# EAGLE design mini_pcie_to_uart_usb (EAGLE 9.6.2)

## Sheet 1 of 2
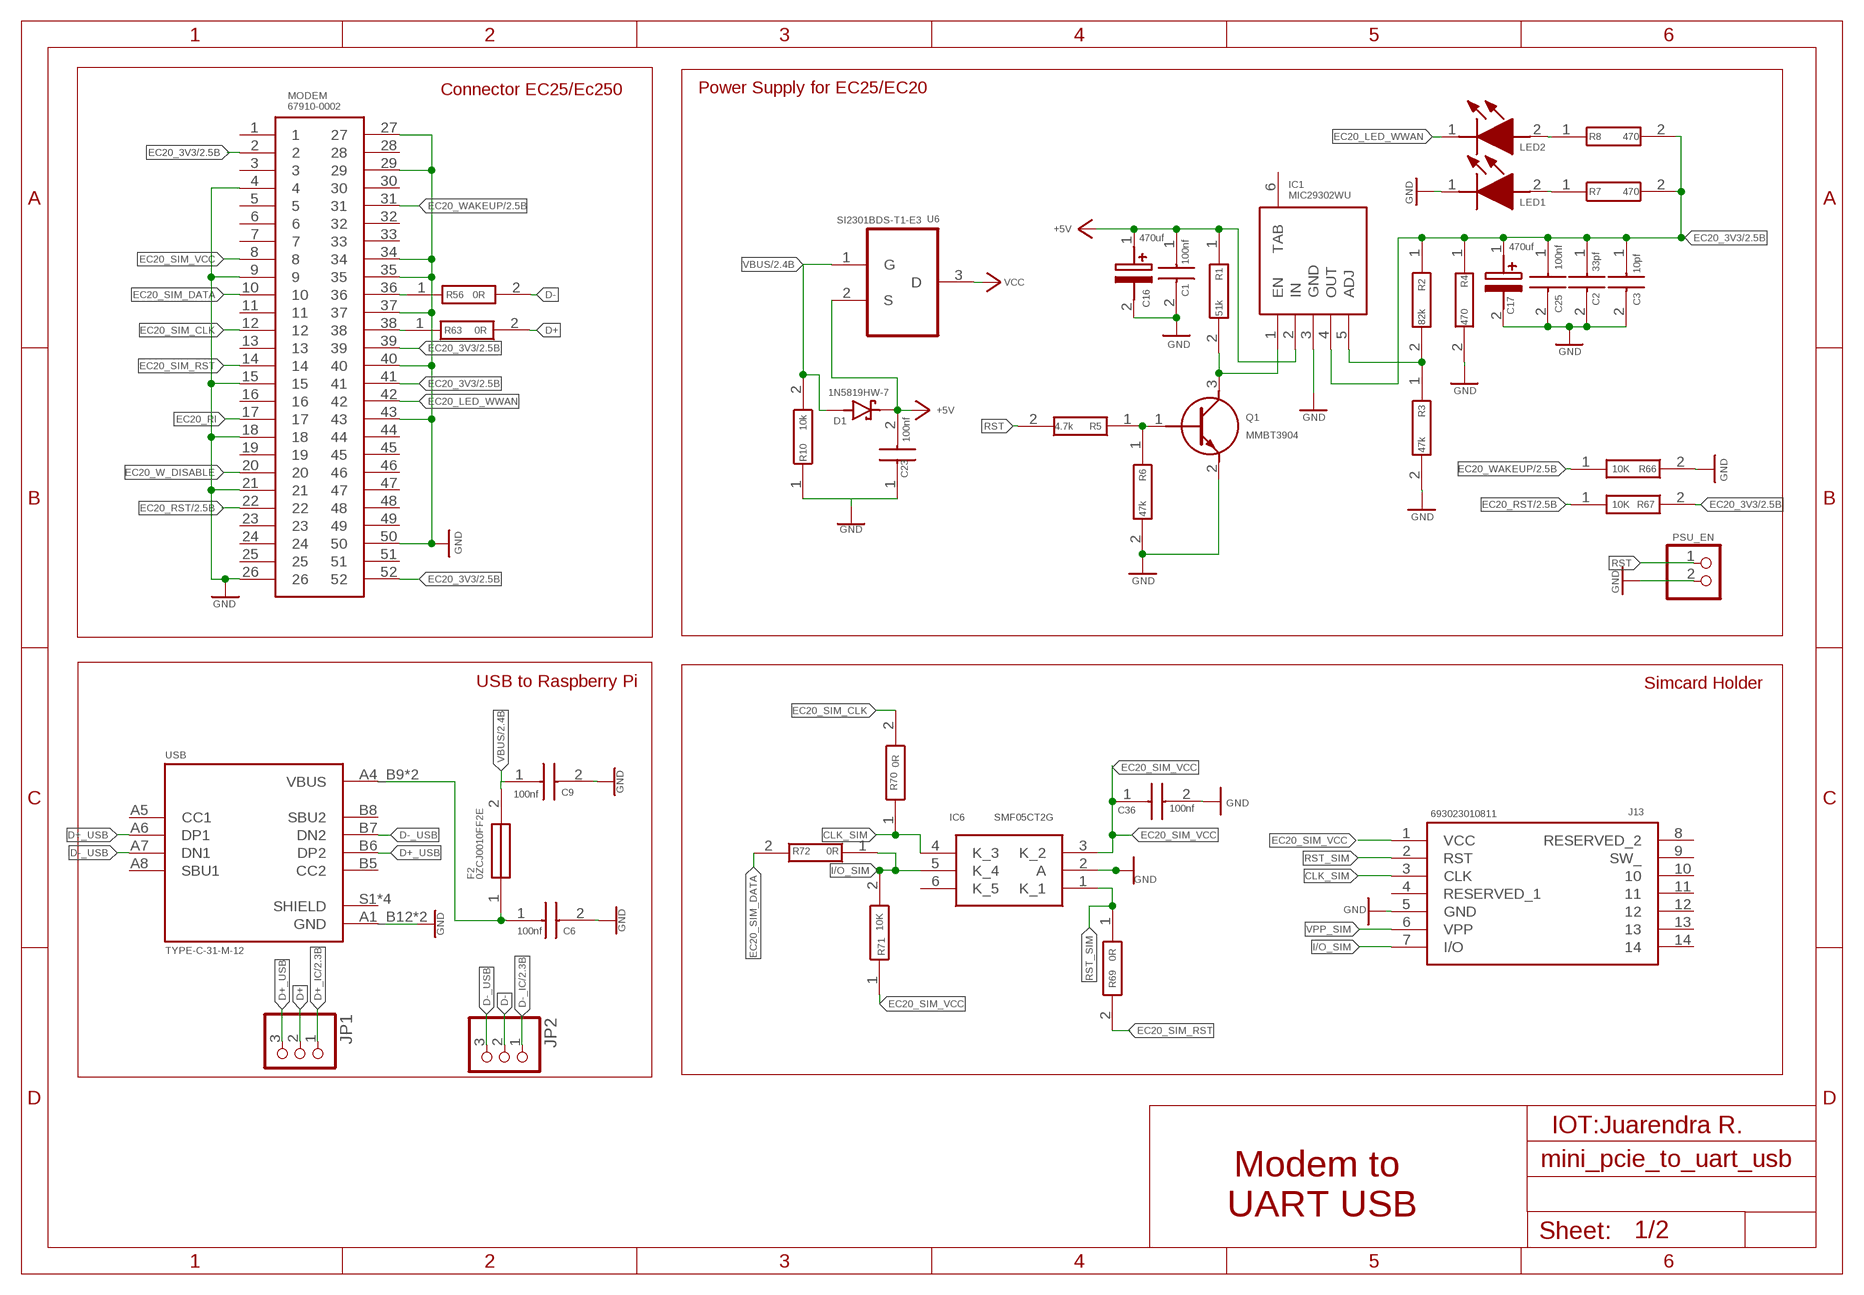
[diagram p0: schematic, sheet 1]

### Parts
C1  100nf  CL10F104ZB8NNNC  [CAPC1608X90N]
C2  33pf  06035A330MAT2A  [CAPC1608X90N]
C3  10pf  06035U100FAT2A  [CAPC1608X90N]
C6  100nf  885012206071  [CAPC1608X87N]
C9  100nf  885012206071  [CAPC1608X87N]
C16  470uf  T55D477M6R3C0030  [CAPPM7343X310N]
C17  470uf  T55D477M6R3C0030  [CAPPM7343X310N]
C23  100nf  885012206071  [CAPC1608X87N]
C25  100nf  CL10F104ZB8NNNC  [CAPC1608X90N]
C36  100nf  CL10F104ZB8NNNC  [CAPC1608X90N]
D1  1N5819HW-7  [SOD3715X145N]
F2  0ZCJ0010FF2E  [FUSC3216X75N]
IC1  MIC29302WU  [MIC29302WU]
IC6  SMF05CT2G  [SOT65P210X110-6N]
J13  693023010811  [693023010811]
JP1  PINHD-1X3  [1X03]
JP2  PINHD-1X3  [1X03]
LED1  HSMR-C170-R0000  [LEDC2012X90N]
LED2  HSMR-C170-R0000  [LEDC2012X90N]
MODEM  67910-0002  [67910-5700]
PSU_EN  PINHD-1X2  [1X02]
Q1  MMBT3904  [SOT95P240X120-3N]
R1  51k  ERJ-PA3F5102V  [ERJP03_PA3_(0603)]
R2  82k  ERJ-P03F8202V  [RESC1609X55N]
R3  47k  ERJ-P03F4702V  [RESC1609X55N]
R4  470  ERJ-P03F4700V  [RESC1609X55N]
R5  4.7k  ERJ-P03F4701V  [RESC1609X55N]
R6  47k  ERJ-P03F4702V  [RESC1609X55N]
R7  470  ERJ-P03F4700V  [RESC1609X55N]
R8  470  ERJ-P03F4700V  [RESC1609X55N]
R10  10k  ESR03EZPJ103  [RESC1608X55N]
R56  0R  CRCW06030000Z0EAC  [RESC1608X55N]
R63  0R  CRCW06030000Z0EAC  [RESC1608X55N]
R66  10K  RT0603DRE0710KL  [RESC1608X55N]
R67  10K  RT0603DRE0710KL  [RESC1608X55N]
R69  0R  CRCW06030000Z0EAC  [RESC1608X55N]
R70  0R  CRCW06030000Z0EAC  [RESC1608X55N]
R71  10K  RT0603DRE0710KL  [RESC1608X55N]
R72  0R  CRCW06030000Z0EAC  [RESC1608X55N]
U6  SI2301BDS-T1-E3  [SOT95P237X112-3N]
USB  TYPE-C-31-M-12  [HRO_TYPE-C-31-M-12]

### Nets
+5V: C1.1 C16.1(+) C23.2 D1.C(K) IC1.2(IN) R1.1 U6.2(S)
CLK_SIM: IC6.4(K_3) J13.3(CLK) R70.1
D+: JP1.2 R63.2
D+_IC: JP1.1 ; also sheet 2
D+_USB: JP1.3 USB.A6(DP1) USB.B6(DP2)
D-: JP2.2 R56.2
D-_IC: JP2.1 ; also sheet 2
D-_USB: JP2.3 USB.A7(DN1) USB.B7(DN2)
EC20_3V3: C2.1 C3.1 C17.1(+) C25.1 IC1.4(OUT) MODEM.2 MODEM.39 MODEM.41 MODEM.52 R2.1 R4.1 R7.2 R8.2 R67.2 ; also sheet 2
EC20_LED_WWAN: LED2.1(K) MODEM.42
EC20_RI: MODEM.17
EC20_RST: MODEM.22 R67.1 ; also sheet 2
EC20_SIM_CLK: MODEM.12 R70.2
EC20_SIM_DATA: MODEM.10 R72.2
EC20_SIM_RST: MODEM.14 R69.2
EC20_SIM_VCC: C36.1 IC6.3(K_2) J13.1(VCC) MODEM.8 R71.1
EC20_W_DISABLE: MODEM.20
EC20_WAKEUP: MODEM.31 R66.1 ; also sheet 2
GND: C1.2 C2.2 C3.2 C6.2 C9.2 C16.2(-) C17.2(-) C23.1 C25.2 C36.2 IC1.3(GND) IC6.2(A) J13.5(GND) LED1.1(K) MODEM.4 MODEM.9 MODEM.15 MODEM.18 MODEM.21 MODEM.26 MODEM.27 MODEM.29 MODEM.34 MODEM.35 MODEM.37 MODEM.40 MODEM.43 MODEM.50 PSU_EN.2 Q1.2(E) R3.2 R4.2 R6.2 R10.1 R66.2 USB.A1_B12(GND) USB.B1_A12(GND) ; also sheet 2
I/O_SIM: IC6.5(K_4) J13.7(I/O) R71.2 R72.1
N$1: IC1.1(EN) Q1.3(C) R1.2
N$2: IC1.5(ADJ) R2.2 R3.1
N$3: Q1.1(B) R5.1 R6.1
N$4: LED1.2(A) R7.1
N$6: C6.1 F2.1 USB.A4_B9(VBUS) USB.B4_A9(VBUS)
N$7: LED2.2(A) R8.1
N$40: MODEM.38 R63.1
N$41: MODEM.36 R56.1
RST: PSU_EN.1 R5.2
RST_SIM: IC6.1(K_1) J13.2(RST) R69.1
VBUS: C9.1 D1.A F2.2 R10.2 U6.1(G) ; also sheet 2
VCC: U6.3(D) ; also sheet 2
VPP_SIM: J13.6(VPP)
Unconnected: IC1.6(TAB) IC6.6(K_5) J13.4(RESERVED_1) J13.8(RESERVED_2) J13.9(SW_) J13.10 J13.11 J13.12 J13.13 J13.14 MODEM.1 MODEM.3 MODEM.5 MODEM.6 MODEM.7 MODEM.11 MODEM.13 MODEM.16 MODEM.19 MODEM.23 MODEM.24 MODEM.25 MODEM.28 MODEM.30 MODEM.32 MODEM.33 MODEM.44 MODEM.45 MODEM.46 MODEM.47 MODEM.48 MODEM.49 MODEM.51 USB.A5(CC1) USB.A8(SBU1) USB.B5(CC2) USB.B8(SBU2) USB.S1(SHIELD) USB.S2(SHIELD) USB.S3(SHIELD) USB.S4(SHIELD)

### Notes on the sheet
- Connector EC25/Ec250 | Power Supply for EC25/EC20
- USB to Raspberry Pi | Simcard Holder
- IOT:Juarendra R.
- Modem to 
  UART USB

## Sheet 2 of 2
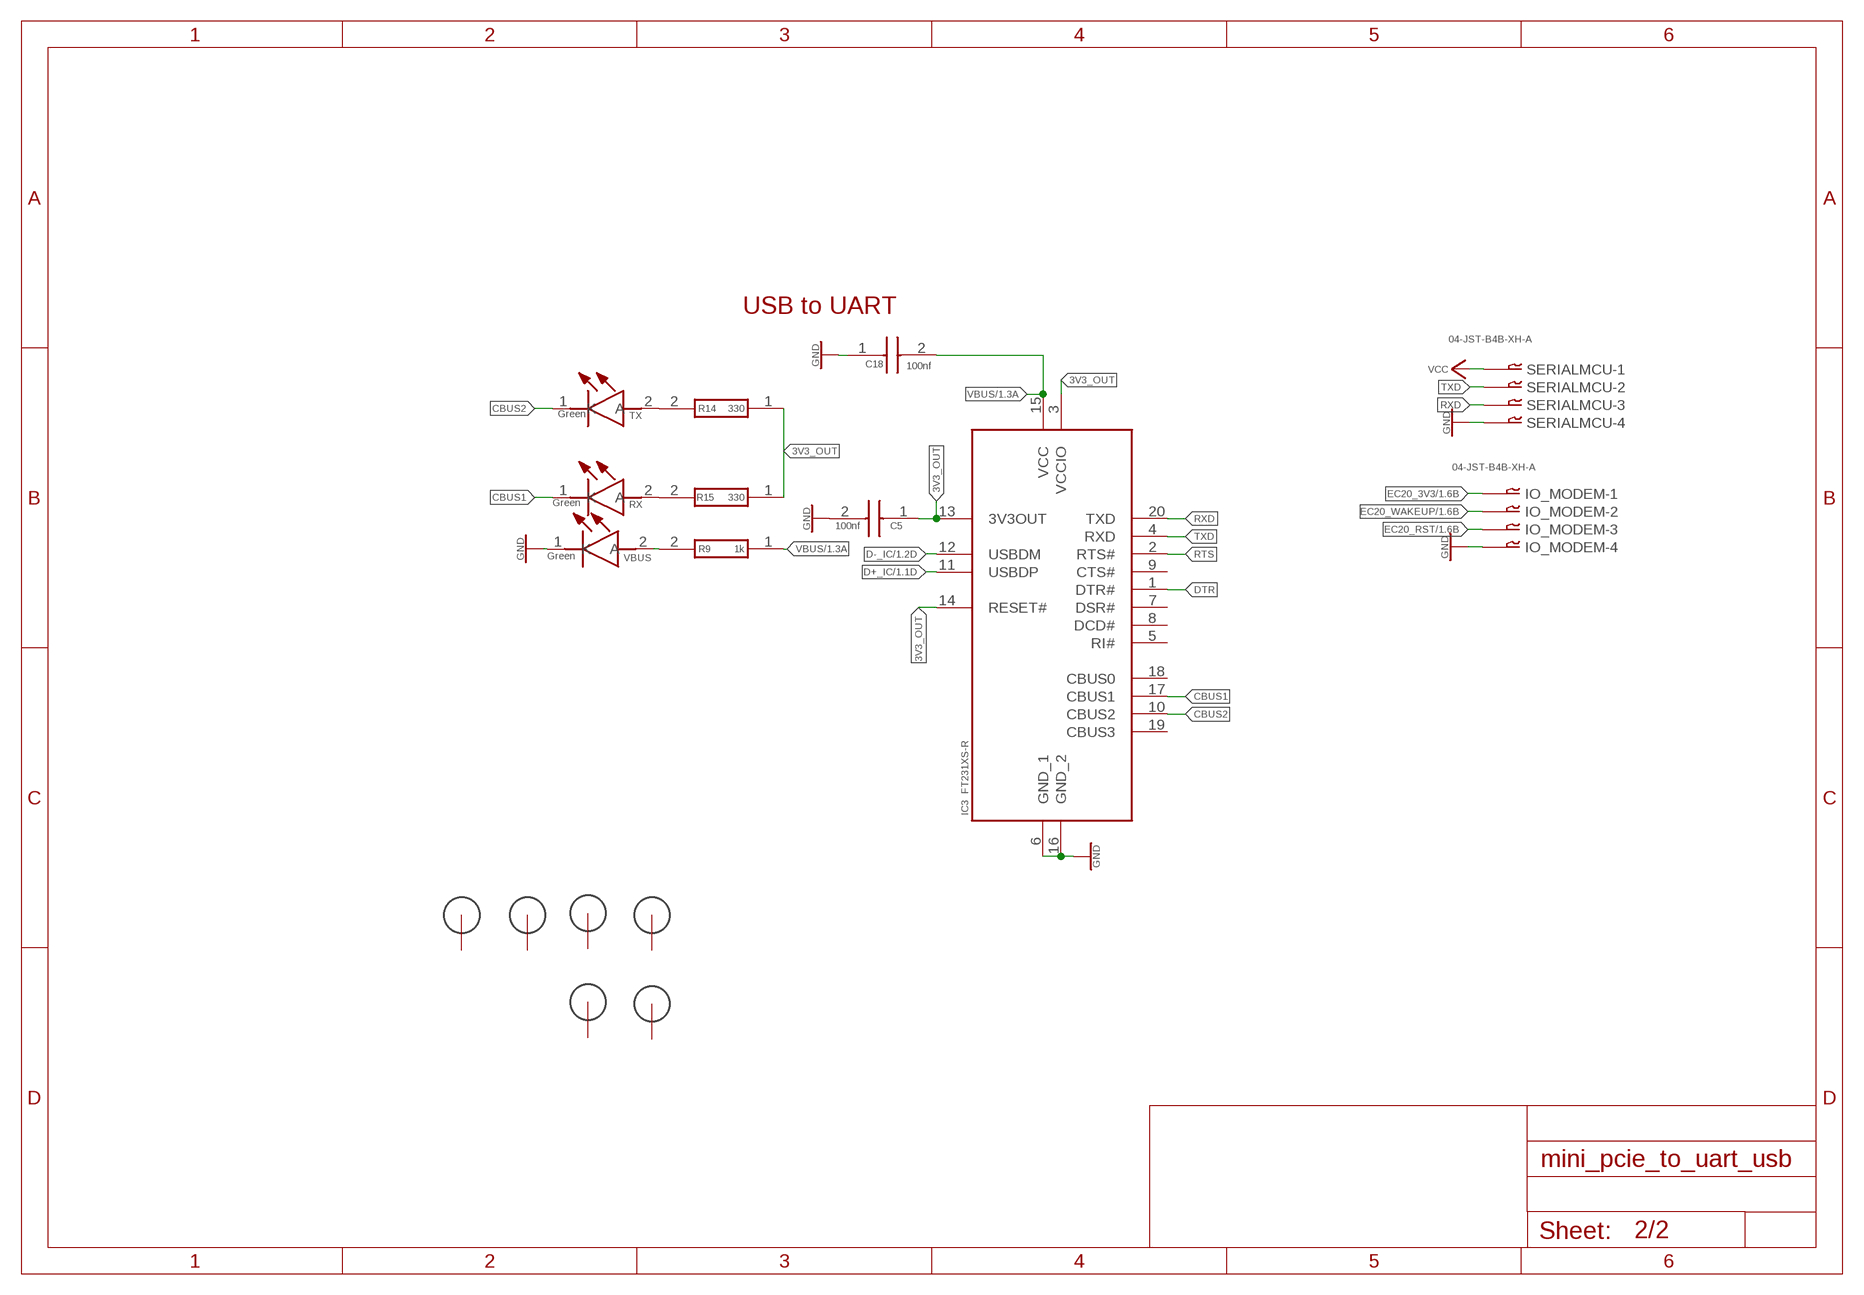
[diagram p1: schematic, sheet 2]

### Parts
C5  100nf  885012206071  [CAPC1608X87N]
C18  100nf  885012206071  [CAPC1608X87N]
H1  3MM_HOLE  [3MM_HOLE]
H2  3MM_HOLE  [3MM_HOLE]
H3  3MM_HOLE  [3MM_HOLE]
H4  3MM_HOLE  [3MM_HOLE]
H5  3MM_HOLE  [3MM_HOLE]
H6  3MM_HOLE  [3MM_HOLE]
IC3  FT231XS-R  [SOP64P599X175-20N]
IO_MODEM  04-JST-B4B-XH-A  [B4B-XH]
R9  1k  ESR03EZPJ102  [RESC1608X55N]
R14  330  ERJ-H3EF3300V  [ERJH3]
R15  330  ERJ-H3EF3300V  [ERJH3]
RX  Green  150080BS75000  [LEDC2012X80N]
SERIALMCU  04-JST-B4B-XH-A  [B4B-XH]
TX  Green  150080BS75000  [LEDC2012X80N]
VBUS  Green  150080BS75000  [LEDC2012X80N]

### Nets
3V3_OUT: C5.1 IC3.3(VCCIO) IC3.13(3V3OUT) IC3.14(RESET#) R14.1 R15.1
CBUS1: IC3.17(CBUS1) RX.1(K)
CBUS2: IC3.10(CBUS2) TX.1(K)
D+_IC: IC3.11(USBDP) ; also sheet 1
D-_IC: IC3.12(USBDM) ; also sheet 1
DTR: IC3.1(DTR#)
EC20_3V3: IO_MODEM.P$1 ; also sheet 1
EC20_RST: IO_MODEM.P$3 ; also sheet 1
EC20_WAKEUP: IO_MODEM.P$2 ; also sheet 1
GND: C5.2 C18.1 IC3.6(GND_1) IC3.16(GND_2) IO_MODEM.P$4 SERIALMCU.P$4 VBUS.1(K) ; also sheet 1
N$5: R15.2 RX.2(A)
N$15: R9.2 VBUS.2(A)
N$20: R14.2 TX.2(A)
RTS: IC3.2(RTS#)
RXD: IC3.20(TXD) SERIALMCU.P$3
TXD: IC3.4(RXD) SERIALMCU.P$2
VBUS: C18.2 IC3.15(VCC) R9.1 ; also sheet 1
VCC: SERIALMCU.P$1 ; also sheet 1
Unconnected: H1.P$1(GND) H1.P$2(GND) H1.P$3(GND) H1.P$4(GND) H1.P$5(GND) H1.P$6(GND) H1.P$7(GND) H1.P$8(GND) H1.P$9(GND) H2.P$1(GND) H2.P$2(GND) H2.P$3(GND) H2.P$4(GND) H2.P$5(GND) H2.P$6(GND) H2.P$7(GND) H2.P$8(GND) H2.P$9(GND) H3.P$1(GND) H3.P$2(GND) H3.P$3(GND) H3.P$4(GND) H3.P$5(GND) H3.P$6(GND) H3.P$7(GND) H3.P$8(GND) H3.P$9(GND) H4.P$1(GND) H4.P$2(GND) H4.P$3(GND) H4.P$4(GND) H4.P$5(GND) H4.P$6(GND) H4.P$7(GND) H4.P$8(GND) H4.P$9(GND) H5.P$1(GND) H5.P$2(GND) H5.P$3(GND) H5.P$4(GND) H5.P$5(GND) H5.P$6(GND) H5.P$7(GND) H5.P$8(GND) H5.P$9(GND) H6.P$1(GND) H6.P$2(GND) H6.P$3(GND) H6.P$4(GND) H6.P$5(GND) H6.P$6(GND) H6.P$7(GND) H6.P$8(GND) H6.P$9(GND) IC3.5(RI#) IC3.7(DSR#) IC3.8(DCD#) IC3.9(CTS#) IC3.18(CBUS0) IC3.19(CBUS3)

### Notes on the sheet
- USB to UART

## Library data of the parts
C1 C25 C36 = Raritan MODEM_GPS:CL10F104ZB8NNNC: Samsung Electro-Mechanics 0603 CL 100nF Ceramic Multilayer Capacitor, 50 V, +85C, Y5V Dielectric, -20 +80% SMD Source: Datasheet; DESCRIPTION: Samsung Electro-Mechanics 0603 CL 100nF Ceramic Multilayer Capacitor, 50 V, +85C, Y5V Dielectric, -20 +80% SMD; HEIGHT: 0.9mm; MANUFACTURER_NAME: Samsung Electro-Mechanics; MANUFACTURER_PART_NUMBER: CL10F104ZB8NNNC; MOUSER_PART_NUMBER: 187-CL10F104ZB8NNNC; MOUSER_PRICE-STOCK: https://www.mouser.co.uk/ProductDetail/Samsung-Electro-Mechanics/CL10F104ZB8NNNC?qs=349EhDEZ59rBbGrsT%2FDZAg%3D%3D
C2 = 06035A330MAT2A:06035A330MAT2A: Multilayer Ceramic Capacitors MLCC - SMD/SMT 50V 33pF C0G 0603 20% Tol Source: Datasheet <https://componentsearchengine.com/Datasheets/1/06035A330MAT2A.pdf>; DESCRIPTION: Multilayer Ceramic Capacitors MLCC - SMD/SMT 50V 33pF C0G 0603 20% Tol; HEIGHT: 0.9mm; MANUFACTURER_NAME: Kyocera AVX; MANUFACTURER_PART_NUMBER: 06035A330MAT2A; MOUSER_PART_NUMBER: 581-06035A330MAT2A; MOUSER_PRICE-STOCK: https://www.mouser.com/Search/Refine.aspx?Keyword=581-06035A330MAT2A
C3 = 06035U100FAT2A:06035U100FAT2A: Multilayer Ceramic Capacitors MLCC - SMD/SMT KGQ15ACG1H100FT NEW GLOBAL PN 50V 10pF C A 581-KGQ15ACG1H100FT Source: Datasheet <https://componentsearchengine.com/Datasheets/1/06031A100FAT2A.pdf>; DESCRIPTION: Multilayer Ceramic Capacitors MLCC - SMD/SMT KGQ15ACG1H100FT NEW GLOBAL PN 50V 10pF C A 581-KGQ15ACG1H100FT; HEIGHT: 0.9mm; MANUFACTURER_NAME: Kyocera AVX; MANUFACTURER_PART_NUMBER: 06035U100FAT2A; MOUSER_PART_NUMBER: 581-06035U100F; MOUSER_PRICE-STOCK: https://www.mouser.co.uk/ProductDetail/KYOCERA-AVX/06035U100FAT2A?qs=TMdO%2Fn%2FCkUL6A7g4po1NrQ%3D%3D
C5 C6 C9 C18 C23 = AccesControlNFC:885012206071: Wurth Elektronik 0603 WCAP-CSGP 100nF Ceramic Multilayer Capacitor, 25 V dc, +125C, X7R Dielectric, +/-10% Source: Datasheet <https://katalog.we-online.com/pbs/datasheet/885012206071.pdf>; DESCRIPTION: Wurth Elektronik 0603 WCAP-CSGP 100nF Ceramic Multilayer Capacitor, 25 V dc, +125C, X7R Dielectric, +/-10%; DIGIKEY_PARTNUMBER: 732-7989-1-ND; DIGIKEY_PRICE-STOCK: https://www.digikey.com/product-detail/en/w%C3%BCrth-elektronik/885012206071/732-7989-1-ND/5454616; HEIGHT: 0.87mm; MANUFACTURER_NAME: Wurth Elektronik; MANUFACTURER_PART_NUMBER: 885012206071; MOUSER_PART_NUMBER: 710-885012206071; MOUSER_PRICE-STOCK: https://www.mouser.co.uk/ProductDetail/Wurth-Elektronik/885012206071?qs=0KOYDY2FL2%2FEBQkuHgvarg%3D%3D
C16 = SamacSys_Parts:T55D477M6R3C0030: Cap Tant Polymer 470uF 6.3VDC D CASE 20% (7.3 X 4.3 X 2.8mm) SMD 7343-30 0.03 Ohm 105C T/R Source: Datasheet <https://www.arrow.com/en/products/t55d477m6r3c0030/vishay>; ARROW_PART_NUMBER: T55D477M6R3C0030; DESCRIPTION: Cap Tant Polymer 470uF 6.3VDC D CASE 20% (7.3 X 4.3 X 2.8mm) SMD 7343-30 0.03 Ohm 105C T/R; HEIGHT: 3.1mm; MANUFACTURER_NAME: Vishay; MANUFACTURER_PART_NUMBER: T55D477M6R3C0030; MOUSER_PART_NUMBER: 74-T55D477M6R3C0030; MOUSER_PRICE-STOCK: https://www.mouser.co.id/ProductDetail/Vishay-Sprague/T55D477M6R3C0030?qs=%2Fha2pyFadui4wZ0nuBUamO9aK%252BYQkDhuleLqs5VgI04AlL4Qf09UDA%3D%3D
C17 = Raritan MODEM_GPS:T55D477M6R3C0030: Cap Tant Polymer 470uF 6.3VDC D CASE 20% (7.3 X 4.3 X 2.8mm) SMD 7343-30 0.03 Ohm 105C T/R Source: Datasheet <https://www.arrow.com/en/products/t55d477m6r3c0030/vishay>; ARROW_PART_NUMBER: T55D477M6R3C0030; DESCRIPTION: Cap Tant Polymer 470uF 6.3VDC D CASE 20% (7.3 X 4.3 X 2.8mm) SMD 7343-30 0.03 Ohm 105C T/R; HEIGHT: 3.1mm; MANUFACTURER_NAME: Vishay; MANUFACTURER_PART_NUMBER: T55D477M6R3C0030; MOUSER_PART_NUMBER: 74-T55D477M6R3C0030; MOUSER_PRICE-STOCK: https://www.mouser.co.id/ProductDetail/Vishay-Sprague/T55D477M6R3C0030?qs=%2Fha2pyFadui4wZ0nuBUamO9aK%252BYQkDhuleLqs5VgI04AlL4Qf09UDA%3D%3D
D1 = 1N5819HW-7:1N5819HW-7: 1N5819HW Series 40 V 1 A Surface Mount Schottky Barrier Rectifier - SOD-123 Check availability <https://pricing.snapeda.com/parts/1N5819HW-7/Diodes%20Inc./view-part?ref=eda>; AVAILABILITY: In Stock; CHECK_PRICES: https://www.snapeda.com/parts/1N5819HW-7/Diodes+Inc./view-part/?ref=eda; DESCRIPTION: Diode Schottky 40 V 1A Surface Mount SOD-123; MF: Diodes Inc.; MP: 1N5819HW-7; PACKAGE: SOD-123 Fairchild Semiconductor; PRICE: None; PURCHASE-URL: https://www.snapeda.com/api/url_track_click_mouser/?unipart_id=51510&manufacturer=Diodes Inc.&part_name=1N5819HW-7&search_term=1n5819; SNAPEDA_LINK: https://www.snapeda.com/parts/1N5819HW-7/Diodes+Inc./view-part/?ref=snap
F2 = 0ZCJ0010FF2E:0ZCJ0010FF2E: Resettable Fuses - PPTC Fuse Source: Datasheet <https://componentsearchengine.com/Datasheets/1/0ZCJ0010FF2E.pdf>; DESCRIPTION: Resettable Fuses - PPTC Fuse; HEIGHT: 0.75mm; MANUFACTURER_NAME: BelFuse; MANUFACTURER_PART_NUMBER: 0ZCJ0010FF2E; MOUSER_PART_NUMBER: 530-0ZCJ0010FF2E; MOUSER_PRICE-STOCK: https://www.mouser.co.uk/ProductDetail/Bel-Fuse/0ZCJ0010FF2E?qs=SRYZG9HaIQ2ZPdy0ahZ08g%3D%3D
H1-H6 = 3mm_special_hole:3MM_HOLE: Cool looking 3mm hole with ground connection
IC1 = MIC29302WU:MIC29302WU: LDO Voltage Regulators 3.0A LDO Adj. + Shutdown Source: Datasheet <https://www.mouser.in/datasheet/2/268/MIC2915x_30x_50x_75x_High_Current_Low_Dropout_Regu-1889172.pdf>; DESCRIPTION: LDO Voltage Regulators 3.0A LDO Adj. + Shutdown; HEIGHT: 5.08mm; MANUFACTURER_NAME: Microchip; MANUFACTURER_PART_NUMBER: MIC29302WU; MOUSER_PART_NUMBER: 998-MIC29302WU; MOUSER_PRICE-STOCK: https://www.mouser.co.uk/ProductDetail/Microchip-Technology/MIC29302WU?qs=kh6iOki%2FeLGH5fS1ZBQ3pA%3D%3D
IC3 = AccesControlNFC:FT231XS-R: FTDI Chip FT231XS-R, Interface RS232, RS422, RS485, SIE, UART 3MBd, 5 V, 20-pin, SSOP Source: Datasheet; DESCRIPTION: FTDI Chip FT231XS-R, Interface RS232, RS422, RS485, SIE, UART 3MBd, 5 V, 20-pin, SSOP; HEIGHT: 1.753mm; MANUFACTURER_NAME: FTDI Chip; MANUFACTURER_PART_NUMBER: FT231XS-R; MOUSER_PART_NUMBER: 895-FT231XS-R; MOUSER_PRICE-STOCK: https://www.mouser.co.uk/ProductDetail/FTDI/FT231XS-R?qs=Gp1Yz1mis3WduRPsgrTbtg%3D%3D
IC6 = SMF05CT2G:SMF05CT2G: 5-Line Transient Voltage Suppressor Array Source: Datasheet <http://www.onsemi.com/pub/Collateral/SMF05C-D.PDF>; DESCRIPTION: 5-Line Transient Voltage Suppressor Array; HEIGHT: 1.1mm; MANUFACTURER_NAME: onsemi; MANUFACTURER_PART_NUMBER: SMF05CT2G; MOUSER_PART_NUMBER: 863-SMF05CT2G; MOUSER_PRICE-STOCK: https://www.mouser.co.uk/ProductDetail/onsemi/SMF05CT2G?qs=xZq1yRCsb1fkTB9yOMghAg%3D%3D
IO_MODEM SERIALMCU = AccesControlNFC:04-JST: JST CONNECTOR
J13 = Raritan MODEM_GPS:693023010811: Micro SIMPushPull-Card Detection Source: Datasheet <https://katalog.we-online.com/em/datasheet/693023010811.pdf>; DESCRIPTION: Micro SIMPushPull-Card Detection; HEIGHT: 4mm; MANUFACTURER_NAME: Wurth Elektronik; MANUFACTURER_PART_NUMBER: 693023010811; MOUSER_PART_NUMBER: 710-693023010811; MOUSER_PRICE-STOCK: https://www.mouser.co.uk/ProductDetail/Wurth-Elektronik/693023010811?qs=a9WhcLg8qCwvzFrXNR2ZFw%3D%3D
JP1 JP2 = pinhead:PINHD-1X3: PIN HEADER
LED1 LED2 = HSMR-C170-R0000:HSMR-C170-R0000: CHIP,TOP MT,INGAN,BLUE - Bulk Source: Datasheet <https://docs.broadcom.com/docs/HSMR-C170-R0000-DS100>; DESCRIPTION: CHIP,TOP MT,INGAN,BLUE - Bulk; HEIGHT: 0.9mm; MANUFACTURER_NAME: Avago Technologies; MANUFACTURER_PART_NUMBER: HSMR-C170-R0000; MOUSER_PART_NUMBER: 630-HSMR-C170-R0000; MOUSER_PRICE-STOCK: https://www.mouser.co.uk/ProductDetail/Broadcom-Avago/HSMR-C170-R0000?qs=tMOYG%252Bw4%252BLw%2FIfre%252BXKNxw%3D%3D
MODEM = Raritan MODEM_GPS:67910-0002: Molex 67910 Series, Right Angle PCB Edge Connector SMT, 52 Way, 0.8mm Pitch, 1.1A Source: Datasheet; DESCRIPTION: Molex 67910 Series, Right Angle PCB Edge Connector SMT, 52 Way, 0.8mm Pitch, 1.1A; DIGIKEY_PARTNUMBER: WM3470CT-ND; DIGIKEY_PRICE-STOCK: https://www.digikey.com/product-detail/en/molex/0679100002/WM3470CT-ND/2405686; HEIGHT: mm; MANUFACTURER_NAME: Molex; MANUFACTURER_PART_NUMBER: 67910-0002; MOUSER_PART_NUMBER: 538-67910-0002; MOUSER_PRICE-STOCK: https://www.mouser.co.uk/ProductDetail/Molex/67910-0002?qs=Nl1avnnkqqxGh9Vp1ExzfQ%3D%3D
PSU_EN = pinhead:PINHD-1X2: PIN HEADER
Q1 = MMBT3904:MMBT3904: SOT-23-3 Source: Datasheet <https://www.onsemi.com/download/data-sheet/pdf/PZT3904-D.pdf>; DESCRIPTION: SOT-23-3; HEIGHT: 1.2mm; MANUFACTURER_NAME: onsemi; MANUFACTURER_PART_NUMBER: MMBT3904; MOUSER_PART_NUMBER: 512-MMBT3904; MOUSER_PRICE-STOCK: https://www.mouser.co.uk/ProductDetail/onsemi-Fairchild/MMBT3904?qs=UMEuL5FsraCg3xKjS4uBJQ%3D%3D
R1 = ERJ-PA3F5102V:ERJ-PA3F5102V: Panasonic ERJPA3 Series Thick Film Surface Mount Resistor 0603 Case 51k +/-1% 0.25W +/-100ppm/C Source: Datasheet <https://componentsearchengine.com/Datasheets/1/ERJ-PA3F5102V.pdf>; DESCRIPTION: Panasonic ERJPA3 Series Thick Film Surface Mount Resistor 0603 Case 51k +/-1% 0.25W +/-100ppm/C; HEIGHT: 0.55mm; MANUFACTURER_NAME: Panasonic; MANUFACTURER_PART_NUMBER: ERJ-PA3F5102V; MOUSER_PART_NUMBER: 667-ERJ-PA3F5102V; MOUSER_PRICE-STOCK: https://www.mouser.com/Search/Refine.aspx?Keyword=667-ERJ-PA3F5102V
R2 = ERJ-P03F8202V:ERJ-P03F8202V: Anti-Surge Thick Film Chip Resistor, 0603 Source: Datasheet <http://industrial.panasonic.com/cdbs/www-data/pdf/RDA0000/AOA0000C102.pdf>; DESCRIPTION: Anti-Surge Thick Film Chip Resistor, 0603; HEIGHT: 0.55mm; MANUFACTURER_NAME: Panasonic; MANUFACTURER_PART_NUMBER: ERJ-P03F8202V
R3 R6 = ERJ-P03F4702V:ERJ-P03F4702V: Thick Film Resistors - SMD 0603 47Kohms 0.2W 1% AEC-Q200 Source: Datasheet <https://componentsearchengine.com/Datasheets/1/ERJ-P03F4702V.pdf>; DESCRIPTION: Thick Film Resistors - SMD 0603 47Kohms 0.2W 1% AEC-Q200; HEIGHT: 0.55mm; MANUFACTURER_NAME: Panasonic; MANUFACTURER_PART_NUMBER: ERJ-P03F4702V; MOUSER_PART_NUMBER: 667-ERJ-P03F4702V; MOUSER_PRICE-STOCK: http://www.mouser.com/Search/ProductDetail.aspx?qs=18kBAoNi3c80quo7IiLR5w%3d%3d
R4 R7 R8 = ERJ-P03F4700V:ERJ-P03F4700V: Thick Film Resistors - SMD 0603 470ohms 0.2W 1% AEC-Q200 Source: Datasheet <http://industrial.panasonic.com/cdbs/www-data/pdf/RDA0000/AOA0000C102.pdf>; DESCRIPTION: Thick Film Resistors - SMD 0603 470ohms 0.2W 1% AEC-Q200; HEIGHT: 0.55mm; MANUFACTURER_NAME: Panasonic; MANUFACTURER_PART_NUMBER: ERJ-P03F4700V; MOUSER_PART_NUMBER: 667-ERJ-P03F4700V; MOUSER_PRICE-STOCK: https://www.mouser.co.uk/ProductDetail/Panasonic/ERJ-P03F4700V?qs=18kBAoNi3c9N6jeKRfIb9g%3D%3D
R5 = ERJ-P03F4701V:ERJ-P03F4701V: Thick Film Resistors - SMD 0603 4.7Kohms 0.2W 1% AEC-Q200 Source: Datasheet <http://industrial.panasonic.com/cdbs/www-data/pdf/RDA0000/AOA0000C102.pdf>; DESCRIPTION: Thick Film Resistors - SMD 0603 4.7Kohms 0.2W 1% AEC-Q200; HEIGHT: 0.55mm; MANUFACTURER_NAME: Panasonic; MANUFACTURER_PART_NUMBER: ERJ-P03F4701V; MOUSER_PART_NUMBER: 667-ERJ-P03F4701V; MOUSER_PRICE-STOCK: https://www.mouser.co.uk/ProductDetail/Panasonic/ERJ-P03F4701V?qs=18kBAoNi3c9lrldXCbY57g%3D%3D
R9 = AccesControlNFC:ESR03EZPJ102: Thick Film Resistors - SMD 0603 1Kohm 5% Anti Surge AEC-Q200 Source: Datasheet <http://www.rohm.com/web/global/datasheet/ESR01MZPF/esr-e>; DESCRIPTION: Thick Film Resistors - SMD 0603 1Kohm 5% Anti Surge AEC-Q200; DIGIKEY_PARTNUMBER: RHM1.0KDCT-ND; DIGIKEY_PRICE-STOCK: https://www.digikey.com/product-detail/en/rohm-semiconductor/ESR03EZPJ102/RHM1-0KDCT-ND/1762924; HEIGHT: 0.55mm; MANUFACTURER_NAME: ROHM Semiconductor; MANUFACTURER_PART_NUMBER: ESR03EZPJ102; MOUSER_PART_NUMBER: 755-ESR03EZPJ102; MOUSER_PRICE-STOCK: https://www.mouser.co.uk/ProductDetail/ROHM-Semiconductor/ESR03EZPJ102?qs=DyUWGjl%252BcVvjMuV%252BzioV7Q%3D%3D
R10 = AccesControlNFC:ESR03EZPJ103: Thick Film Resistors - SMD 0603 10Kohm 5% Anti Surge AEC-Q200 Source: Datasheet <https://componentsearchengine.com/Datasheets/1/ESR03EZPJ103.pdf>; DESCRIPTION: Thick Film Resistors - SMD 0603 10Kohm 5% Anti Surge AEC-Q200; DIGIKEY_PARTNUMBER: RHM10KDCT-ND; DIGIKEY_PRICE-STOCK: https://www.digikey.com/product-detail/en/rohm-semiconductor/ESR03EZPJ103/RHM10KDCT-ND/1762925; HEIGHT: 0.55mm; MANUFACTURER_NAME: ROHM Semiconductor; MANUFACTURER_PART_NUMBER: ESR03EZPJ103; MOUSER_PART_NUMBER: 755-ESR03EZPJ103; MOUSER_PRICE-STOCK: https://www.mouser.com/Search/Refine.aspx?Keyword=755-ESR03EZPJ103
R14 R15 = AccesControlNFC:ERJ-H3EF3300V: Power Rating 0.125W,Resistance 330 Ohm,LxW(EIA) 1.6 x 0.8 (EIA:0603) mm Source: Datasheet <http://industrial.panasonic.com/cdbs/www-data/pdf/RDQ0000/ast-ind-151033.pdf>; DESCRIPTION: Power Rating 0.125W,Resistance 330 Ohm,LxW(EIA) 1.6 x 0.8 (EIA:0603) mm; HEIGHT: mm; MANUFACTURER_NAME: Panasonic; MANUFACTURER_PART_NUMBER: ERJ-H3EF3300V; MOUSER_PART_NUMBER: 667-ERJ-H3EF3300V; MOUSER_PRICE-STOCK: https://www.mouser.co.uk/ProductDetail/Panasonic/ERJ-H3EF3300V?qs=eP2BKZSCXI61roRLPi8W7w%3D%3D
R56 R63 R69 R70 R72 = Raritan MODEM_GPS:CRCW06030000Z0EAC: Thick Film Resistors - SMD Source: Datasheet <https://www.vishay.com/docs/28773/crcwce3.pdf>; DESCRIPTION: Thick Film Resistors - SMD; DIGIKEY_PARTNUMBER: 541-4012-1-ND; DIGIKEY_PRICE-STOCK: https://www.digikey.com/product-detail/en/vishay-dale/CRCW06030000Z0EAC/541-4012-1-ND/7928695; HEIGHT: 0.55mm; MANUFACTURER_NAME: Vishay; MANUFACTURER_PART_NUMBER: CRCW06030000Z0EAC; MOUSER_PART_NUMBER: 71-CRCW06030000Z0EAC; MOUSER_PRICE-STOCK: https://www.mouser.co.uk/ProductDetail/Vishay-Dale/CRCW06030000Z0EAC?qs=E3Y5ESvWgWPIXY%2FelhkL3A%3D%3D
R66 R67 R71 = Raritan MODEM_GPS:RT0603DRE0710KL: Thin Film Resistors - SMD 10K ohm 0.5% 1/10W Source: Datasheet <https://datasheet.datasheetarchive.com/originals/distributors/Datasheets_SAMA/a1f8f48f216d234b3e6a96d43a77a0c1.pdf>; DESCRIPTION: Thin Film Resistors - SMD 10K ohm 0.5% 1/10W; HEIGHT: 0.55mm; MANUFACTURER_NAME: YAGEO (PHYCOMP); MANUFACTURER_PART_NUMBER: RT0603DRE0710KL
RX TX VBUS = AccesControlNFC:150080BS75000: LED,Wurth Elektronik,150080BS75000 Wurth Elektronik 150080BS75000, WL-SMCW Series Blue LED, 470 nm 2012 (0805) Clear, Rectangle Lens SMD package Source: Datasheet <https://katalog.we-online.com/led/datasheet/150080BS75000.pdf>; DESCRIPTION: LED,Wurth Elektronik,150080BS75000 Wurth Elektronik 150080BS75000, WL-SMCW Series Blue LED, 470 nm 2012 (0805) Clear, Rectangle Lens SMD package; HEIGHT: 0.8mm; MANUFACTURER_NAME: Wurth Elektronik; MANUFACTURER_PART_NUMBER: 150080BS75000; MOUSER_PART_NUMBER: 710-150080BS75000; MOUSER_PRICE-STOCK: https://www.mouser.co.uk/ProductDetail/Wurth-Elektronik/150080BS75000?qs=2kOmHSv6VfT2tBo3UPVqAQ%3D%3D
U6 = SI2301BDS-T1-E3:SI2301BDS-T1-E3: MOSFET Check availability <https://pricing.snapeda.com/parts/SI2301BDS-T1-E3/Vishay/view-part?ref=eda>; AVAILABILITY: In Stock; CHECK_PRICES: https://www.snapeda.com/parts/SI2301BDS-T1-E3/Vishay+Siliconix/view-part/?ref=eda; DESCRIPTION: MOSFET,P-Ch,VDSS -20V,RDS(ON) 0.08Ohm,ID -2.2A,TO-236 (SOT-23),PD 0.7W,VGS +/-8V | Siliconix / Vishay SI2301BDS-T1-E3; MF: Vishay; MP: SI2301BDS-T1-E3; PACKAGE: SOT-23-3 Vishay Siliconix; PRICE: None; PURCHASE-URL: https://www.snapeda.com/api/url_track_click_mouser/?unipart_id=277675&manufacturer=Vishay&part_name=SI2301BDS-T1-E3&search_term=si2301; SNAPEDA_LINK: https://www.snapeda.com/parts/SI2301BDS-T1-E3/Vishay+Siliconix/view-part/?ref=snap
USB = TYPE-C-31-M-12:TYPE-C-31-M-12: Check availability <https://pricing.snapeda.com/parts/TYPE-C-31-M-12/HRO%20Electronics%20Co.%2C%20Ltd./view-part?ref=eda>; AVAILABILITY: Not in stock; CHECK_PRICES: https://www.snapeda.com/parts/TYPE-C-31-M-12/HRO+Electronics+Co.%252C+Ltd./view-part/?ref=eda; DESCRIPTION: USB Connectors 24 Receptacle 1 8.94*7.3mm RoHS; MF: HRO Electronics Co., Ltd.; MP: TYPE-C-31-M-12; PACKAGE: Package; PRICE: None; SNAPEDA_LINK: https://www.snapeda.com/parts/TYPE-C-31-M-12/HRO+Electronics+Co.%252C+Ltd./view-part/?ref=snap

## Board
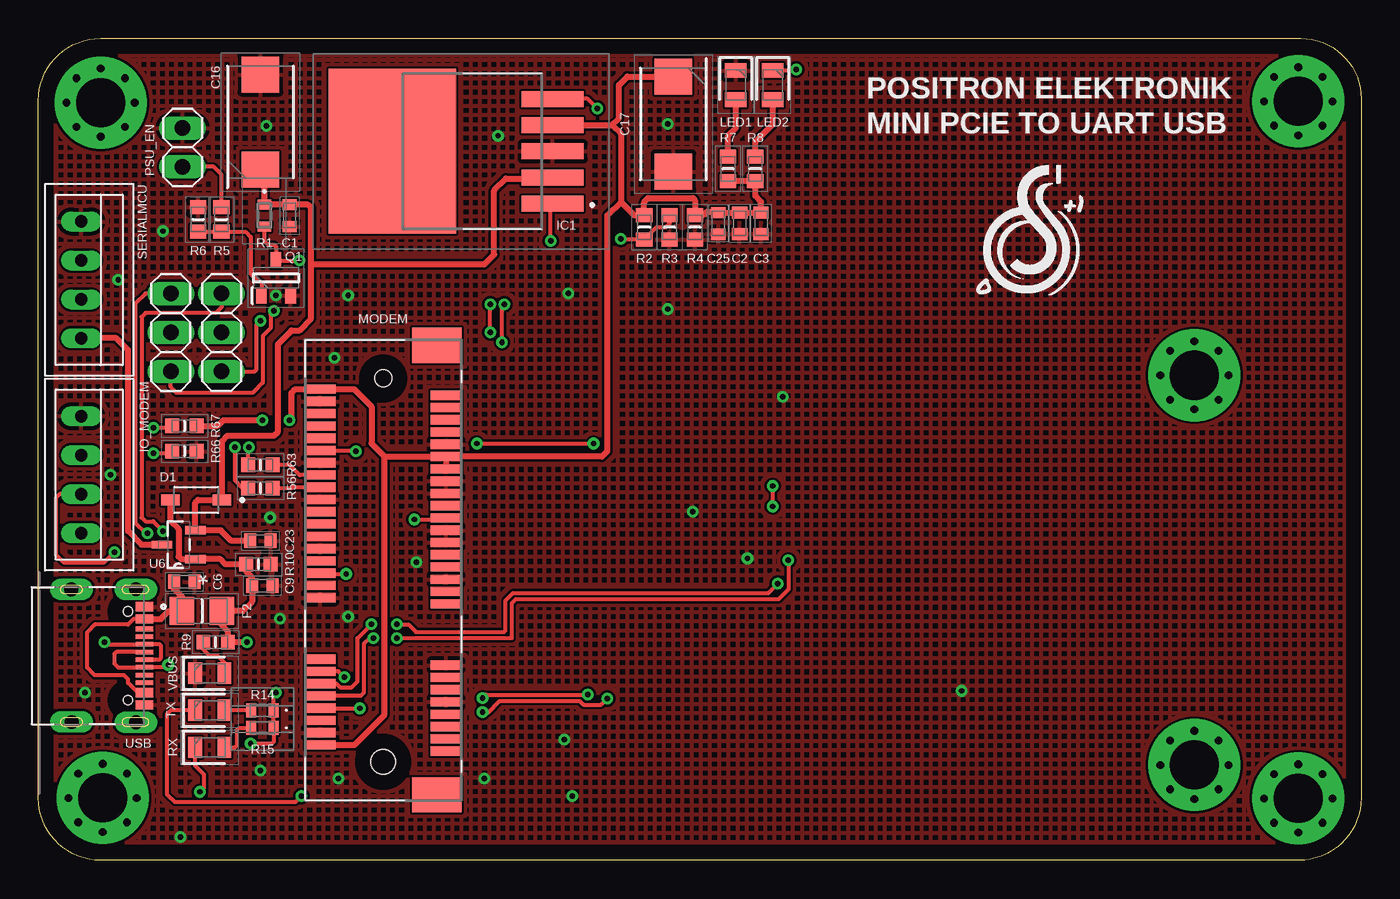
[diagram p2: board, top side]
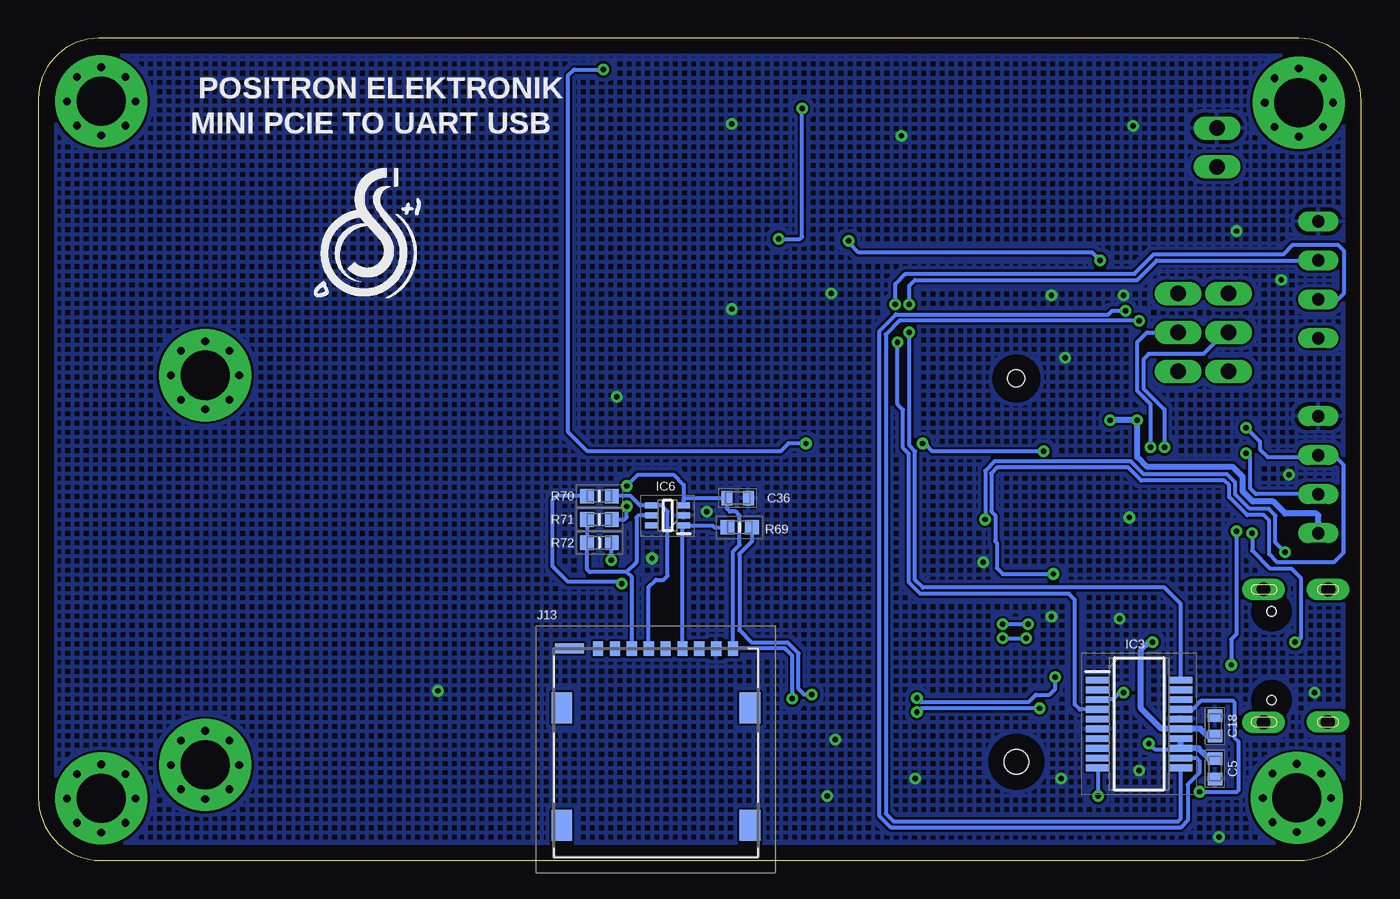
[diagram p3: board, bottom side, seen from below]

Size 86.23 x 53.59 mm. Coordinates in mm from the lower left corner, seen from the top.
Outline: 82.3,53.59 arc-90 86.23,49.66 86.23,4.06 arc-90 82.17,0 4.06,0 arc-90 0,4.06 0,49.53 arc-90 4.06,53.59 82.3,53.59
Copper layers (1*16): Top 0.035mm / dielectric 1.5mm / Bottom 0.035mm
Design rules "default *": minimum track width 6mil, minimum drill 0.35mm, track to track 6mil, track to pad 6mil, pad to pad 6mil, via to via 6mil, smd to smd 6mil, copper to edge 40mil, drill to drill 6mil, minimum pad ring 10mil, minimum via ring 8mil, stop-mask expansion 4mil, vias tented up to drill 0.35mm, thermal gap 10mil

### Footprints (pad centres in the part's own frame; a part is rotated, then mirrored left to right if it is on the bottom)
CAPC1608X90N = smd 0.73 x 0.94: 1 -0.71,0; 2 0.71,0
CAPC1608X90N' = smd 0.78 x 0.99: 1 -0.7,0; 2 0.7,0
CAPC1608X87N = smd 0.8 x 0.94: 1 -0.67,0; 2 0.67,0
CAPPM7343X310N = smd 2.35 x 2.45: 1 -3.1,0; 2 3.1,0
SOD3715X145N = smd 1.21 x 0.73: A 1.68,0; C -1.68,0
FUSC3216X75N = smd 1.61 x 1.82: 1 -1.3,0; 2 1.3,0
3MM_HOLE = drill 3.2 pad 6: P$1 0,0 | drill 0.5 pad 0.61: P$2 0,2.223; P$3 0,-2.223; P$4 2.223,0; P$5 -2.223,0; P$6 -1.587,1.587; P$7 1.587,1.587; P$8 1.587,-1.587; P$9 -1.587,-1.587
MIC29302WU = smd 1.041 x 4.039: 1 -3.404,0; 2 -1.702,0; 3 0,0; 4 1.702,0; 5 3.404,0 | smd 10.744 x 8.306: 6 0,10.452
SOP64P599X175-20N = smd 1.526 x 0.435: 1 -2.712,2.858; 2 -2.712,2.222; 3 -2.712,1.588; 4 -2.712,0.952; 5 -2.712,0.318; 6 -2.712,-0.318; 7 -2.712,-0.952; 8 -2.712,-1.588; 9 -2.712,-2.222; 10 -2.712,-2.858; 11 2.712,-2.858; 12 2.712,-2.222; 13 2.712,-1.588; 14 2.712,-0.952; 15 2.712,-0.318; 16 2.712,0.318; 17 2.712,0.952; 18 2.712,1.588; 19 2.712,2.222; 20 2.712,2.858
SOT65P210X110-6N = smd 0.85 x 0.4: 1 -1.05,0.65; 2 -1.05,0; 3 -1.05,-0.65; 4 1.05,-0.65; 5 1.05,0; 6 1.05,0.65
B4B-XH = drill 0.8 long: P$1 3.81,0; P$2 1.27,0; P$3 -1.27,0; P$4 -3.81,0
693023010811 = smd 0.67 x 0.95: 1 5.03,6.575; 2 1.73,6.575; 3 -0.47,6.575; 4 -2.67,6.575; 5 3.93,6.575; 6 0.63,6.575; 7 -1.57,6.575; 8 -3.77,6.575; 9 2.83,6.575 | smd 1.89 x 0.67: 10 -5.615,6.575 | smd 1.35 x 2: 11 -6.13,2.7; 12 -6.13,-4.95; 13 6.13,-4.95; 14 6.13,2.7
1X03 = drill 1.016 long: 1 -2.54,0; 2 0,0; 3 2.54,0
LEDC2012X90N = smd 0.95 x 1.4: 1 -0.95,0; 2 0.95,0
67910-5700 = smd 0.6 x 2: 1 -11.8,-4.1; 2 -11.4,4.1; 3 -11,-4.1; 4 -10.6,4.1; 5 -10.2,-4.1; 6 -9.8,4.1; 7 -9.4,-4.1; 8 -9,4.1; 9 -8.6,-4.1; 10 -8.2,4.1; 11 -7.8,-4.1; 12 -7.4,4.1; 13 -7,-4.1; 14 -6.6,4.1; 15 -6.2,-4.1; 16 -5.8,4.1; 17 -2.2,-4.1; 18 -1.8,4.1; 19 -1.4,-4.1; 20 -1,4.1; 21 -0.6,-4.1; 22 -0.2,4.1; 23 0.2,-4.1; 24 0.6,4.1; 25 1,-4.1; 26 1.4,4.1; 27 1.8,-4.1; 28 2.2,4.1; 29 2.6,-4.1; 30 3,4.1; 31 3.4,-4.1; 32 3.8,4.1; 33 4.2,-4.1; 34 4.6,4.1; 35 5,-4.1; 36 5.4,4.1; 37 5.8,-4.1; 38 6.2,4.1; 39 6.6,-4.1; 40 7,4.1; 41 7.4,-4.1; 42 7.8,4.1; 43 8.2,-4.1; 44 8.6,4.1; 45 9,-4.1; 46 9.4,4.1; 47 9.8,-4.1; 48 10.2,4.1; 49 10.6,-4.1; 50 11,4.1; 51 11.4,-4.1; 52 11.8,4.1 | smd 2.3 x 3.2: 53 -14.65,-3.5; 54 14.65,-3.5 | hole 1.6: -12.5,0 | hole 1.1: 12.5,0
1X02 = drill 1.016 long: 1 -1.27,0; 2 1.27,0
SOT95P240X120-3N = smd 1.05 x 0.7: 1 -1.15,0.95; 2 -1.15,-0.95; 3 1.15,0
ERJP03_PA3_(0603) = smd 0.65 x 0.9: 1 -0.725,0; 2 0.725,0
RESC1609X55N = smd 0.9 x 1.05: 1 -0.8,0; 2 0.8,0
RESC1608X55N = smd 0.9 x 0.95: 1 -0.8,0; 2 0.8,0
ERJH3 = smd 0.65 x 0.9: 1 -0.725,0; 2 0.725,0
LEDC2012X80N = smd 0.9 x 1.4: 1 -0.95,0; 2 0.95,0
SOT95P237X112-3N = smd 1.321 x 0.559: 1 -1.092,0.94; 2 -1.092,-0.94 | smd 1.321 x 0.508: 3 1.092,0
HRO_TYPE-C-31-M-12 = smd 0.6 x 1.14: A1_B12 -3.2,4.75; A4_B9 -2.4,4.75; B1_A12 3.2,4.75; B4_A9 2.4,4.75 | smd 0.3 x 1.14: A5 -1.25,4.75; A6 -0.25,4.75; A7 0.25,4.75; A8 1.25,4.75; B5 1.75,4.75; B6 0.75,4.75; B7 -0.75,4.75; B8 -1.75,4.75 | drill 0.9 pad 1.067 long: S1 -4.339,4.198; S2 4.339,4.198; S3 -4.318,-0.007; S4 4.318,0.007 | hole 0.6: -2.89,3.68; 2.89,3.68

### Placement (x,y rotation side)
C1  16.38,42.04 270 top
C2  33pf  [CAPC1608X90N']  45.72,41.53 270 top
C3  10pf  [CAPC1608X90N']  47.12,41.53 270 top
C5  9.53,5.97 270 bottom
C6  9.53,18.16 0 top
C9  14.61,17.91 0 top
C16  14.48,48.13 90 top
C17  41.4,48.01 270 top
C18  9.53,8.76 270 bottom
C23  14.48,20.83 180 top
C25  44.32,41.53 270 top
C36  40.64,23.62 0 bottom
D1  10.29,23.5 180 top
F2  10.67,16.26 0 top
H1  75.36,31.62 0 top
H2  4.06,49.4 0 top
H3  75.36,6.21 0 top
H4  4.19,4.06 0 top
H5  82.14,49.49 0 top
H6  82.14,4.03 0 top
IC1  33.53,46.23 90 top
IC3  14.48,8.89 0 bottom
IC6  45.21,22.48 180 bottom
IO_MODEM  2.79,25.15 270 top
J13  45.97,7.24 0 bottom
JP1  11.94,34.42 90 top
JP2  8.64,34.42 90 top
LED1  45.47,50.55 270 top
LED2  47.88,50.55 270 top
MODEM  22.48,18.92 90 top
PSU_EN  9.4,46.48 90 top
Q1  15.49,37.97 90 top
R1  14.73,42.04 270 top
R2  39.5,41.27 270 top
R3  41.15,41.27 270 top
R4  42.8,41.27 270 top
R5  11.94,41.78 90 top
R6  10.41,41.78 90 top
R7  44.96,45.09 270 top
R8  46.74,45.09 270 top
R9  11.56,14.22 180 top
R10  14.35,19.3 180 top
R14  14.61,9.78 180 top
R15  14.61,8.64 180 top
R56  14.48,24.26 180 top
R63  14.48,25.78 180 top
R66  9.53,26.67 0 top
R67  9.53,28.32 0 top
R69  40.51,21.72 0 bottom
R70  49.66,23.75 180 bottom
R71  49.66,22.23 180 bottom
R72  49.66,20.7 0 bottom
RX  11.18,7.37 0 top
SERIALMCU  2.79,37.85 270 top
TX  11.18,9.78 0 top
U6  9.14,20.57 180 top
USB  2.16,13.34 270 top
VBUS  11.18,12.19 0 top

### Tracks (layer width: path | path; a pad name or v marks a point on that pad's centre or on a via)
3V3_OUT  (via drill 0.35)
  Top 0.254: 13.88,7.66 v13.84,7.62 15.24,7.62 15.37,7.75 15.37,8.6 R15.1 R14.1 15.33,10.76 v15.49,10.92
  Bottom 0.254: v15.49,10.92 15.75,10.92 16.19,10.48 IC3.3 | v13.84,7.62 13.46,7.24 11.83,7.24 IC3.13
  Bottom 0.406: C5.1 9.94,6.64 10.6,7.3 IC3.13 IC3.14
+5V
  Top 0.406: C23.2 12.57,20.83 11.89,21.51 U6.2 10.24,23.32 10.41,23.5 D1.C 11.97,27.33 12.32,27.69 15.37,27.69 15.62,27.94 15.62,33.66 16.51,34.54 17.02,34.54 17.78,35.31 17.78,38.86 | 17.78,38.86 17.78,42.55 17.58,42.75 C1.1 14.75,42.75 R1.1 14.73,44.78 C16.1 | 17.78,38.86 29.08,38.86 29.72,39.5 29.72,43.69 30.48,44.45 33.45,44.45 IC1.2
CBUS1  (via drill 0.35)
  Top 0.254: v10.54,4.47 10.79,4.72 10.79,5.59 10.23,6.16 RX.1
  Bottom 0.254: IC3.17 10.99,9.84 10.41,10.41 8.38,10.41 8.26,10.29 8.26,8 8,7.75 8,4.57 8.13,4.45 10.52,4.45 v10.54,4.47
CBUS2  (via drill 0.35)
  Top 0.254: TX.1 8.64,9.78 8.38,9.53 8.38,4.32 8.89,3.81 16.76,3.81 v17.14,4.19
  Bottom 0.254: v17.14,4.19 17.14,5.99 IC3.10
CLK_SIM
  Bottom 0.254: R70.1 47.62,23.75 47.01,23.13 IC6.4 45.61,23.13 45.21,22.73 45.21,18.54 45.47,18.29 45.97,18.29 46.44,17.82 J13.3
D+  (via drill 0.35)
  Top 0.254: R63.2 13.68,26.89 v13.72,26.92
  Bottom 0.254: v13.72,26.92 13.72,29.72 14.61,30.61 14.61,33.78 13.97,34.42 JP1.2
D+_IC  (via drill 0.35)
  Top 0.254: JP1.1 14.1,31.88 14.22,32 14.22,34.92 v14.48,35.18
  Bottom 0.254: v14.48,35.18 30.1,35.18 30.99,34.29 30.99,3.05 30.48,2.54 11.94,2.54 11.77,2.71 IC3.11
D+_USB  (via drill 0.35)
  Top 0.254: USB.A6 5.08,13.59 4.95,13.46 4.95,12.83 5.21,12.57 6.9,12.57 USB.B6 6.92,12.57 8.3,12.57 v8.47,12.74 | JP1.3 11.94,36.07 11.56,35.69 6.99,35.69 6.73,35.43 6.73,22.35 6.99,22.1 7.49,22.1 v8.13,21.46
  Bottom 0.254: v8.47,12.74 8.47,14.39 8.13,14.73 v8.13,21.46
D-  (via drill 0.35)
  Top 0.254: v12.81,26.92 12.81,24.79 13.34,24.26 R56.2
  Bottom 0.254: JP2.2 8.89,34.42 10.29,33.02 13.84,33.02 14.2,32.66 14.2,30.77 12.83,29.4 12.83,26.94 v12.81,26.92
D-_IC  (via drill 0.35)
  Top 0.254: v15.37,35.84 15.14,35.6 15.14,34.69 14.63,34.19 14.63,31.14 13.97,30.48 9.02,30.48 8.64,30.86 JP2.1
  Bottom 0.254: IC3.12 10.73,6.67 10.54,6.48 10.54,5.71 11.3,4.95 11.3,2.6 11.77,2.13 30.65,2.13 31.39,2.88 31.39,34.52 30.33,35.59 16.48,35.59 16.23,35.84 v15.37,35.84
D-_USB  (via drill 0.35)
  Top 0.254: USB.A7 7.88,13.09 8,13.21 8,13.97 7.87,14.1 6.92,14.1 USB.B7 4.46,14.09 v4.32,14.22 | JP2.3 6.99,36.96 6.33,36.3 6.33,22 6.99,21.34 v7.11,21.34
  Bottom 0.254: v4.32,14.22 4.19,14.22 3.94,14.48 3.94,18.41 4.55,19.02 5.94,19.02 7.11,20.19 v7.11,21.34
EC20_3V3  (via drill 0.35)
  Top 0.406: IC1.4 37.41,47.93 | 37.97,42.93 37.97,47.37 37.41,47.93 | 37.97,42.93 38.82,42.08 R2.1 39.5,42.93 39.75,43.18 42.67,43.18 42.8,43.05 R4.1 43.34,42.08 43.56,42.29 44.27,42.29 C25.1 C2.1 C3.1 47.12,42.93 46.74,43.31 R8.2 R7.2 | 37.41,47.93 37.85,48.36 37.85,50.55 38.41,51.11 C17.1 | 37.97,42.93 37.08,42.04 37.08,26.67 36.74,26.32 MODEM.41 | MODEM.41 MODEM.39 | 22.57,26.32 21.72,27.18 21.72,29.59 20.59,30.72 MODEM.52 16.75,30.72 16.51,30.48 16.51,28.86 v16.36,28.7 | 22.57,26.32 MODEM.41 | MODEM.2 20.6,7.52 22.57,9.49 22.57,26.32 | R67.2 11.68,28.32 12.06,28.7 v14.61,28.7
  Bottom 0.406: v16.36,28.7 v14.61,28.7 14.61,26.29 13.97,25.65 8.38,25.65 7.72,24.99 7.72,24.06 7.06,23.39 5.74,23.39 4.95,22.61 2.92,22.61 2.79,22.48 IO_MODEM.P$1
EC20_LED_WWAN  (via drill 0.35)
  Top 0.254: MODEM.42 20.65,26.72 v20.7,26.67 | v49.4,51.56 49.34,51.5 LED2.1 | v28.57,27.18 v36.2,27.18
  Bottom 0.254: v20.7,26.67 27.94,26.67 28.45,27.18 v28.57,27.18 | v49.4,51.56 51.31,51.56 51.69,51.18 51.69,27.94 50.42,26.67 37.85,26.67 37.34,27.18 v36.2,27.18
EC20_RST  (via drill 0.35)
  Top 0.254: 18.32,18.67 MODEM.22 18.87,18.72 18.92,18.67 v20.07,18.67 | R67.1 8.6,28.19 v7.49,28.19
  Bottom 0.254: 2.67,26.29 IO_MODEM.P$3 | 2.67,26.29 1.65,26.29 1.14,25.78 1.14,20.07 1.78,19.43 5.46,19.43 5.99,19.96 5.99,22.15 6.35,22.5 7.43,22.5 8.61,23.69 8.61,24.47 8.91,24.77 14.34,24.77 15.18,25.61 23.73,25.61 24.11,25.23 24.11,22.75 23.85,22.5 23.85,20.8 23.75,20.7 23.75,19.05 23.37,18.67 v20.07,18.67 | 2.67,26.29 6.1,26.29 6.6,26.8 6.6,27.3 v7.49,28.19
EC20_SIM_CLK  (via drill 0.35)
  Top 0.254: MODEM.12 19.42,11.52 19.67,11.28 20.42,11.28 20.8,11.66 20.8,14.47 v21.72,15.39 | v23.37,15.39 23.39,15.37 24.13,15.37 24.61,14.88 30.35,14.88 30.45,14.99 30.45,16.93 30.95,17.42 47.59,17.42 v48.2,18.03
  Bottom 0.254: v21.72,15.39 v23.37,15.39 | v48.2,18.03 48.33,18.16 51.69,18.16 52.7,19.18 52.7,23.5 52.45,23.75 R70.2
EC20_SIM_DATA  (via drill 0.35)
  Top 0.254: v48.9,19.56 48.9,17.65 48.26,17.02 31.11,17.02 30.86,16.76 30.86,14.48 v23.37,14.48 | v21.84,14.48 21.59,14.48 21.21,14.1 21.21,10.92 21.01,10.72 MODEM.10
  Bottom 0.254: R72.2 48.9,20.66 v48.9,19.56 | v23.37,14.48 v21.84,14.48
EC20_SIM_RST  (via drill 0.35)
  Top 0.254: v19.94,11.94 19.55,12.32 MODEM.14 | v28.96,10.56 29.19,10.79 v35.81,10.79
  Bottom 0.254: R69.2 39.71,20.8 40.54,19.98 40.54,15.01 39.75,14.22 37.4,14.22 36.68,13.5 36.68,11.18 36.3,10.79 v35.81,10.79 | v19.94,11.94 19.94,11.18 20.32,10.79 21.21,10.79 21.69,10.31 28.7,10.31 v28.96,10.56
EC20_SIM_VCC  (via drill 0.35)
  Top 0.254: v47.88,23.07 v47.88,24.41 | MODEM.8 20.94,9.92 v20.95,9.91 | v28.96,9.65 29.34,9.65 30.07,10.39 35.29,10.39 35.54,10.14 36.68,10.14 v37.08,10.54
  Bottom 0.254: R71.1 48.01,22.23 47.88,22.36 v47.88,23.07 | v47.88,24.41 47.14,25.15 44.83,25.15 44.16,24.48 IC6.3 44.16,23.53 44.07,23.62 C36.1 41.35,22.93 41.15,22.73 40.77,22.73 40.51,22.48 40.51,20.57 40.94,20.14 J13.1 37.56,13.81 37.08,13.34 v37.08,10.54 | v28.96,9.65 28.7,9.91 v20.95,9.91
EC20_WAKEUP  (via drill 0.35)
  Top 0.254: v7.49,26.54 8.6,26.54 R66.1 | IO_MODEM.P$2 1.4,23.88 1.14,23.62 1.14,19.94 1.65,19.43 4.29,19.43 v4.95,20.09 | v24.51,22.23 26.48,22.23 MODEM.31
  Bottom 0.254: IO_MODEM.P$2 6.86,23.88 7.24,24.26 7.24,26.29 v7.49,26.54 | v4.95,20.09 5.59,20.72 5.59,22.48 6.02,22.91 7.26,22.91 8.2,23.86 8.2,24.64 8.74,25.17 14.17,25.17 15.01,26.01 23.9,26.01 24.51,25.4 v24.51,22.23
GND  (via drill 0.35)
  other vias: 20.19,36.83 15.49,36.83 8.13,41.02 5.21,37.85 14.86,47.88 29.97,47.24 41.02,48.01 34.54,36.96 41.02,35.94 24.64,19.43 46.23,19.68 34.29,7.87 60.2,11.05 48.51,30.23 19.3,32.77 20.19,15.88 15.75,15.75 4.7,25.15 15.11,22.35 3.05,10.92 14.48,5.84 9.27,1.52 19.56,5.33 34.8,4.19 29.08,5.33 42.67,22.73
  pour Top (hatched): 0,53.72 87.12,53.72 87.12,-0.76 -1.4,-0.76 -1.4,53.47 -1.27,53.59 -1.14,53.72
  pour Bottom (hatched): -0.76,53.72 87.12,53.72 87.12,-0.64 -1.4,-0.64 -1.4,53.47 -1.14,53.72
I/O_SIM
  Bottom 0.254: R71.2 R72.1 50.46,18.96 50.29,18.8 47.88,18.8 | IC6.5 47.12,22.48 47.24,22.35 47.24,19.43 47.88,18.8 | J13.7 47.54,18.46 47.88,18.8
N$1  (via drill 0.35)
  Top 0.254: R1.2 14.73,40.39 14.99,40.13 15.37,40.13 15.49,40.01 Q1.3 v17.02,39.12 | v33.4,40.39 33.4,42.7 IC1.1
  Bottom 0.254: v17.02,39.12 17.53,39.62 32.77,39.62 33.4,40.26 v33.4,40.39
N$2  (via drill 0.35)
  Top 0.254: R3.1 41.15,41.53 40.89,41.27 40.3,41.27 R2.2 38.01,40.48 v37.97,40.51 | v36.45,49.02 35.81,49.66 33.55,49.66 IC1.5
  Bottom 0.254: v37.97,40.51 36.58,40.51 36.45,40.64 v36.45,49.02
N$3
  Top 0.254: R6.1 R5.1 13.5,40.98 13.84,40.64 13.84,38.23 14.1,37.97 14.22,37.97 14.54,37.65 Q1.1
N$4
  Top 0.406: R7.1 44.96,47.24 45.47,47.75 LED1.2
N$5
  Top 0.254: RX.2 12.83,7.37 12.95,7.49 12.95,8.51 13.08,8.64 R15.2
N$6
  Top 0.254: USB.B4_A9 6.46,10.94 5.84,11.56 5.84,11.81 5.59,12.06 3.68,12.06 3.17,12.57 3.17,14.86 3.68,15.37 5.84,15.37 6.21,15.73 USB.A4_B9
  Top 0.406: USB.A4_B9 7.99,15.73 8.51,16.26 F2.1 9.37,17.18 8.86,17.69 C6.1
N$7
  Top 0.406: R8.1 46.74,46.86 47.88,48.01 LED2.2
N$15
  Top 0.254: VBUS.2 12.13,12.89 11.68,13.34 11.18,13.34 10.76,13.75 R9.2
N$20
  Top 0.254: R14.2 TX.2
N$40
  Top 0.254: MODEM.38 17.04,25.12 16.38,25.78 R63.1
N$41
  Top 0.254: MODEM.36 16.58,24.32 16.51,24.26 R56.1
RST
  Top 0.254: R5.2 11.94,44.7 11.43,45.21 PSU_EN.1
RST_SIM
  Bottom 0.254: J13.2 44.24,21.75 IC6.1 42.28,21.83 42.16,21.72 R69.1
RXD  (via drill 0.35)
  Top 0.254: v29.46,34.42 v29.46,36.24
  Bottom 0.254: IC3.20 11.77,16.72 12.83,17.78 28.57,17.78 29.08,18.29 29.08,26.67 29.46,27.05 v29.46,34.42 | v29.46,36.24 29.46,37.47 29.08,37.85 14.61,37.85 13.34,39.12 SERIALMCU.P$3
TXD  (via drill 0.35)
  Top 0.254: v30.23,33.78 30.23,36.1 v30.37,36.24
  Bottom 0.254: IC3.4 18.35,9.84 18.67,10.16 18.67,16.99 19.05,17.37 28.74,17.37 29.49,18.12 29.49,26.5 29.87,26.88 29.87,29.36 30.23,29.72 v30.23,33.78 | v30.37,36.24 30.37,37.57 29.69,38.25 14.77,38.25 13.5,39.52 5.05,39.52 4.45,40.13 1.52,40.13 1.14,39.75 1.14,36.96 1.52,36.58 SERIALMCU.P$2
VBUS  (via drill 0.35)
  Top 0.406: v13.59,14.22 R9.1 12.36,14.95 11.97,15.34 F2.2 13.34,16.26 13.94,16.86 C9.1 13.94,18.45 13.55,18.83 R10.2 12.19,19.3 11.86,19.63 U6.1 9.32,19.63 9.14,19.81 9.14,21.59 8.61,22.13 D1.A
  Bottom 0.406: v13.59,14.22 13.84,14.22 14.35,13.72 14.35,9.91 13.02,8.57 IC3.15 10.48,8.57 10,8.09 C18.2
VCC
  Top 0.406: U6.3 6.73,20.57 5.84,21.46 5.84,33.27 5.08,34.04 SERIALMCU.P$1

### Text on the board
tPlace: POSITRON ELEKTRONIK | MINI PCIE TO UART USB
bPlace: POSITRON ELEKTRONIK | MINI PCIE TO UART USB